# EAGLE design display (EAGLE 7.7.0)
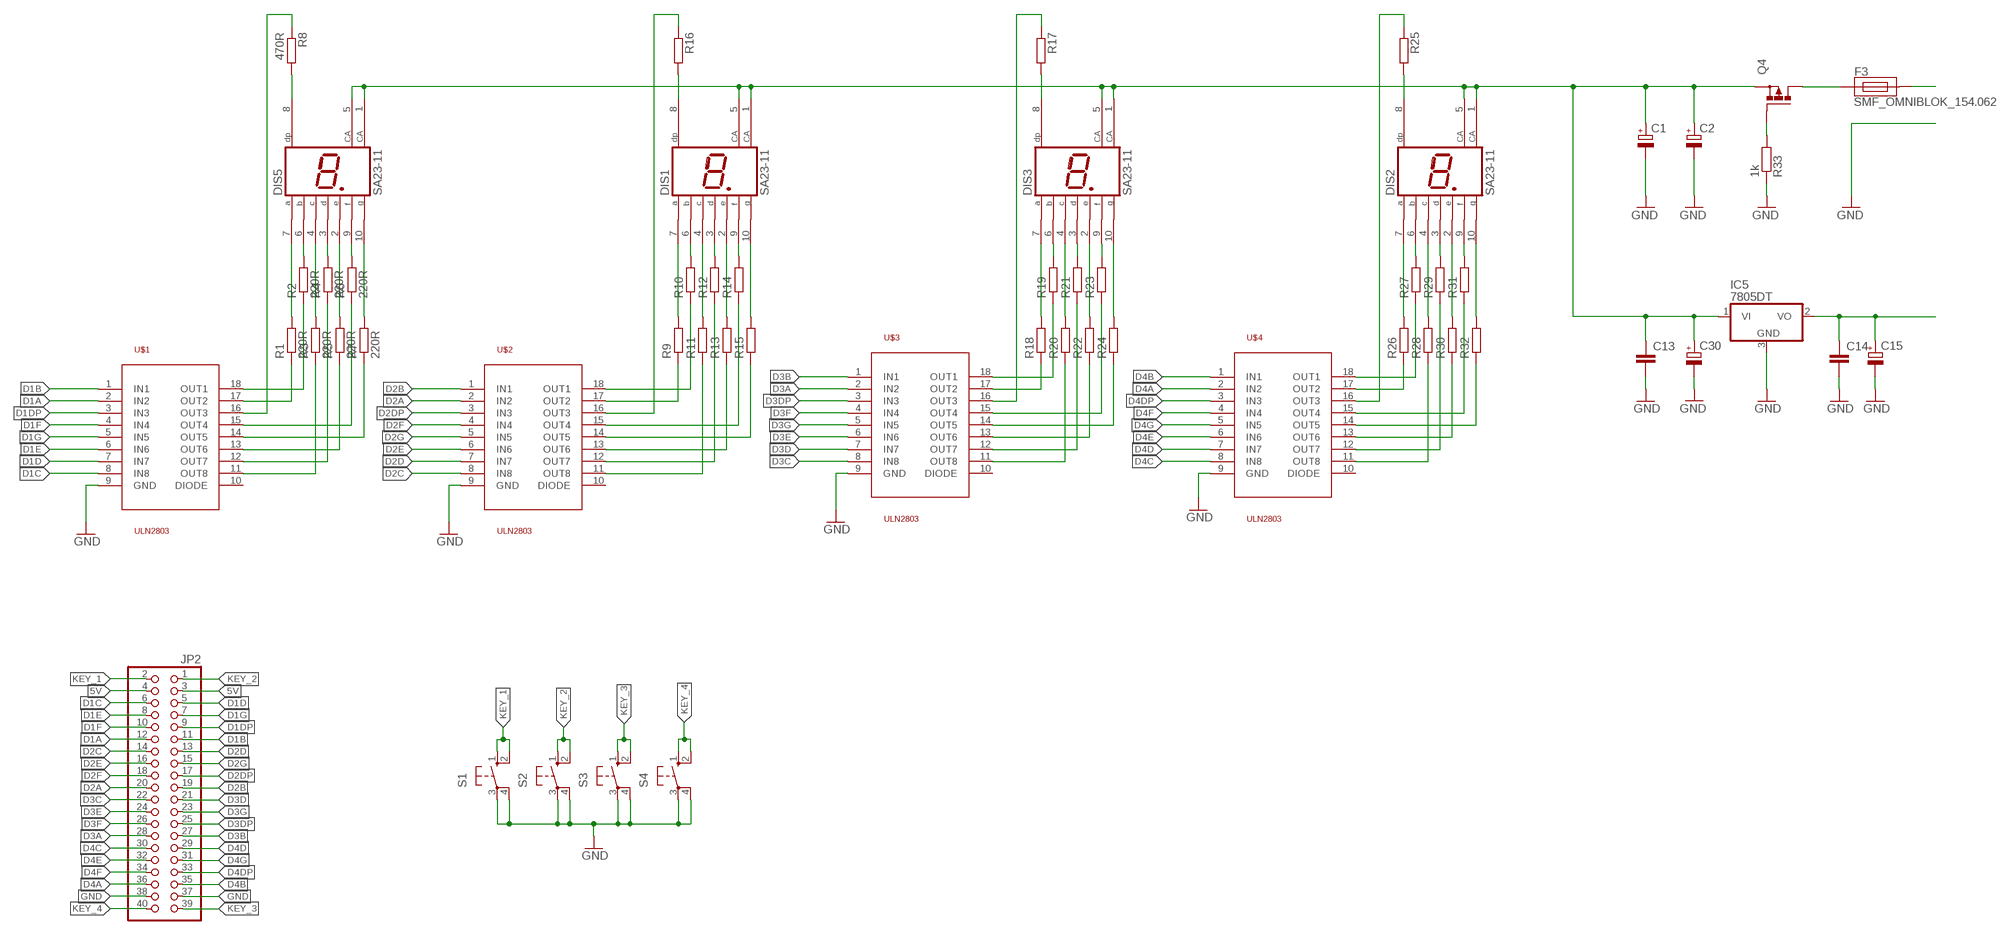
[diagram p0: schematic, sheet 1]

## Parts
C1  CPOL-EUSMCD  [SMC_D]
C2  CPOL-EUSMCD  [SMC_D]
C13  C-EUC0603  [C0603]
C14  C-EUC0603  [C0603]
C15  CPOL-EUSMCB  [SMC_B]
C30  CPOL-EUSMCC  [SMC_C]
DIS1  SA23-11  [SX23-XX]
DIS2  SA23-11  [SX23-XX]
DIS3  SA23-11  [SX23-XX]
DIS5  SA23-11  [SX23-XX]
F3  SMF_OMNIBLOK_154.062  [NANO2_SMF_FUSEBLOCK]
IC5  7805DT  [TO252]
JP2  PINHD-2X20_2.54-SMD  [2X20SMD]
Q4  P-MOSFET-SO8  [SO-08]
R1  220R  R-EU_R0603  [R0603]
R2  220R  R-EU_R0603  [R0603]
R3  220R  R-EU_R0603  [R0603]
R4  220R  R-EU_R0603  [R0603]
R5  220R  R-EU_R0603  [R0603]
R6  220R  R-EU_R0603  [R0603]
R7  220R  R-EU_R0603  [R0603]
R8  470R  R-EU_R0603  [R0603]
R9  R-EU_R0603  [R0603]
R10  R-EU_R0603  [R0603]
R11  R-EU_R0603  [R0603]
R12  R-EU_R0603  [R0603]
R13  R-EU_R0603  [R0603]
R14  R-EU_R0603  [R0603]
R15  R-EU_R0603  [R0603]
R16  R-EU_R0603  [R0603]
R17  R-EU_R0603  [R0603]
R18  R-EU_R0603  [R0603]
R19  R-EU_R0603  [R0603]
R20  R-EU_R0603  [R0603]
R21  R-EU_R0603  [R0603]
R22  R-EU_R0603  [R0603]
R23  R-EU_R0603  [R0603]
R24  R-EU_R0603  [R0603]
R25  R-EU_R0603  [R0603]
R26  R-EU_R0603  [R0603]
R27  R-EU_R0603  [R0603]
R28  R-EU_R0603  [R0603]
R29  R-EU_R0603  [R0603]
R30  R-EU_R0603  [R0603]
R31  R-EU_R0603  [R0603]
R32  R-EU_R0603  [R0603]
R33  1k  R-EU_R0603  [R0603]
S1  40-XX  [B3F-40XX]
S2  40-XX  [B3F-40XX]
S3  40-XX  [B3F-40XX]
S4  40-XX  [B3F-40XX]
U$1  ULN2803  [SO18L]
U$2  ULN2803  [SO18L]
U$3  ULN2803  [SO18L]
U$4  ULN2803  [SO18L]

## Nets
5V: C14.1 C15.+ IC5.2(VO) JP2.3 JP2.4
9V: C1.+ C2.+ C13.1 C30.+ DIS1.1(CA) DIS1.5(CA) DIS2.1(CA) DIS2.5(CA) DIS3.1(CA) DIS3.5(CA) DIS5.1(CA) DIS5.5(CA) IC5.1(VI) Q4.1(S) Q4.2(S) Q4.3(S)
D1A: JP2.12 U$1.2(IN2)
D1B: JP2.11 U$1.1(IN1)
D1C: JP2.6 U$1.8(IN8)
D1D: JP2.5 U$1.7(IN7)
D1DP: JP2.9 U$1.3(IN3)
D1E: JP2.8 U$1.6(IN6)
D1F: JP2.10 U$1.4(IN4)
D1G: JP2.7 U$1.5(IN5)
D2A: JP2.20 U$2.2(IN2)
D2B: JP2.19 U$2.1(IN1)
D2C: JP2.14 U$2.8(IN8)
D2D: JP2.13 U$2.7(IN7)
D2DP: JP2.17 U$2.3(IN3)
D2E: JP2.16 U$2.6(IN6)
D2F: JP2.18 U$2.4(IN4)
D2G: JP2.15 U$2.5(IN5)
D3A: JP2.28 U$3.2(IN2)
D3B: JP2.27 U$3.1(IN1)
D3C: JP2.22 U$3.8(IN8)
D3D: JP2.21 U$3.7(IN7)
D3DP: JP2.25 U$3.3(IN3)
D3E: JP2.24 U$3.6(IN6)
D3F: JP2.26 U$3.4(IN4)
D3G: JP2.23 U$3.5(IN5)
D4A: JP2.36 U$4.2(IN2)
D4B: JP2.35 U$4.1(IN1)
D4C: JP2.30 U$4.8(IN8)
D4D: JP2.29 U$4.7(IN7)
D4DP: JP2.33 U$4.3(IN3)
D4E: JP2.32 U$4.6(IN6)
D4F: JP2.34 U$4.4(IN4)
D4G: JP2.31 U$4.5(IN5)
GND: C1.- C2.- C13.2 C14.2 C15.- C30.- IC5.3(GND) JP2.37 JP2.38 R33.1 S1.3(P) S1.4(P1) S2.3(P) S2.4(P1) S3.3(P) S3.4(P1) S4.3(P) S4.4(P1) U$1.9(GND) U$2.9(GND) U$3.9(GND) U$4.9(GND)
KEY_1: JP2.2 S1.1(S) S1.2(S1)
KEY_2: JP2.1 S2.1(S) S2.2(S1)
KEY_3: JP2.39 S3.1(S) S3.2(S1)
KEY_4: JP2.40 S4.1(S) S4.2(S1)
N$1: DIS5.7(A) R1.2
N$2: DIS5.6(B) R2.2
N$3: F3.2
N$4: Q4.4(G) R33.2
N$11: DIS5.4(C) R3.2
N$12: DIS5.3(D) R4.2
N$13: DIS5.2(E) R5.2
N$14: DIS5.9(F) R6.2
N$15: DIS5.10(G) R7.2
N$16: DIS5.8(DP) R8.2
N$17: DIS1.7(A) R9.2
N$18: DIS1.4(C) R11.2
N$19: DIS1.2(E) R13.2
N$20: DIS1.10(G) R15.2
N$21: DIS1.6(B) R10.2
N$22: DIS1.3(D) R12.2
N$23: DIS1.9(F) R14.2
N$24: DIS1.8(DP) R16.2
N$25: DIS3.8(DP) R17.2
N$26: DIS3.7(A) R18.2
N$27: DIS3.4(C) R20.2
N$37: DIS3.2(E) R22.2
N$40: DIS3.10(G) R24.2
N$41: DIS3.6(B) R19.2
N$42: DIS3.3(D) R21.2
N$43: DIS3.9(F) R23.2
N$44: DIS2.8(DP) R25.2
N$45: DIS2.7(A) R26.2
N$46: DIS2.4(C) R28.2
N$47: DIS2.2(E) R30.2
N$52: F3.1 Q4.5(D) Q4.6(D) Q4.7(D) Q4.8(D)
N$53: DIS2.10(G) R32.2
N$54: DIS2.6(B) R27.2
N$55: DIS2.3(D) R29.2
N$56: DIS2.9(F) R31.2
N$57: R5.1 U$1.13(OUT6)
N$58: R4.1 U$1.12(OUT7)
N$59: R3.1 U$1.11(OUT8)
N$60: R7.1 U$1.14(OUT5)
N$69: R6.1 U$1.15(OUT4)
N$70: R8.1 U$1.16(OUT3)
N$71: R1.1 U$1.17(OUT2)
N$72: R2.1 U$1.18(OUT1)
N$73: R15.1 U$2.14(OUT5)
N$74: R14.1 U$2.15(OUT4)
N$75: R16.1 U$2.16(OUT3)
N$76: R9.1 U$2.17(OUT2)
N$77: R10.1 U$2.18(OUT1)
N$78: R11.1 U$2.11(OUT8)
N$79: R12.1 U$2.12(OUT7)
N$80: R13.1 U$2.13(OUT6)
N$81: R24.1 U$3.14(OUT5)
N$82: R23.1 U$3.15(OUT4)
N$83: R17.1 U$3.16(OUT3)
N$84: R18.1 U$3.17(OUT2)
N$85: R19.1 U$3.18(OUT1)
N$86: R20.1 U$3.11(OUT8)
N$87: R21.1 U$3.12(OUT7)
N$88: R22.1 U$3.13(OUT6)
N$89: R32.1 U$4.14(OUT5)
N$90: R31.1 U$4.15(OUT4)
N$91: R25.1 U$4.16(OUT3)
N$92: R26.1 U$4.17(OUT2)
N$93: R27.1 U$4.18(OUT1)
N$94: R28.1 U$4.11(OUT8)
N$95: R29.1 U$4.12(OUT7)
N$96: R30.1 U$4.13(OUT6)
Unconnected: U$1.10(DIODE) U$2.10(DIODE) U$3.10(DIODE) U$4.10(DIODE)

## Library data of the parts
C1 C2 C15 C30 = rcl:CPOL-EU: POLARIZED CAPACITOR, European symbol
C13 C14 = rcl:C-EU: CAPACITOR, European symbol
DIS1-DIS3 DIS5 = display-kingbright:SA23-11: LED DISPLAY 1-character 7 segment, decimal point right
F3 = _hhn_littlefuse_Nano2SMF_2:SMF_OMNIBLOK_154: Littlefuse SMF OMNI-BLOK (R) Fuse Holder with Installed Fuse (NANO2 SMF): Series 154 Source: http://www.littlefuse.com Technologies (ROHS-compliant): Very Fast-Acting Fuse Installed: 154.x = rating x mA 154 0[..]y = rating y A Slow-Acting Fuse Installed (Slo-Blo (R)) 154.xT = rating x mA 154 0[..]yT = rating y A Author: Dipl.-Ing. FH Rainer Bayer HHN Hochschule Heilbronn, rainer.bayer@hs-heilbronn.de Ingenieurbüro ing-rb, mail@ing-rb.de
IC5 = linear:78*: Positive VOLTAGE REGULATOR Source: http://cache.national.com/ds/LM/LM78L05.pdf http://www.fairchildsemi.com/ds/LM/LM7805.pdf
JP2 = pinhead-2:PINHD-2X20: PIN HEADER
Q4 = transistor-power:P-MOSFET-SO8: P-Channel MOSFET Example: FDS4435A; P-Channel Logic Level PowerTrench® MOSFET FDS4465; P-Channel 1.8V Specified PowerTrench® MOSFET Source: www.fairchildsemi.com
R1-R33 = rcl:R-EU_: RESISTOR, European symbol
S1-S4 = switch-omron:40-XX: OMRON SWITCH; MF: OMRON COMPONENTS USA; MPN: B3F-4000; OC_FARNELL: 176434; OC_NEWARK: 36K3105
U$1-U$4 = uln2803:ULN2803

## Board
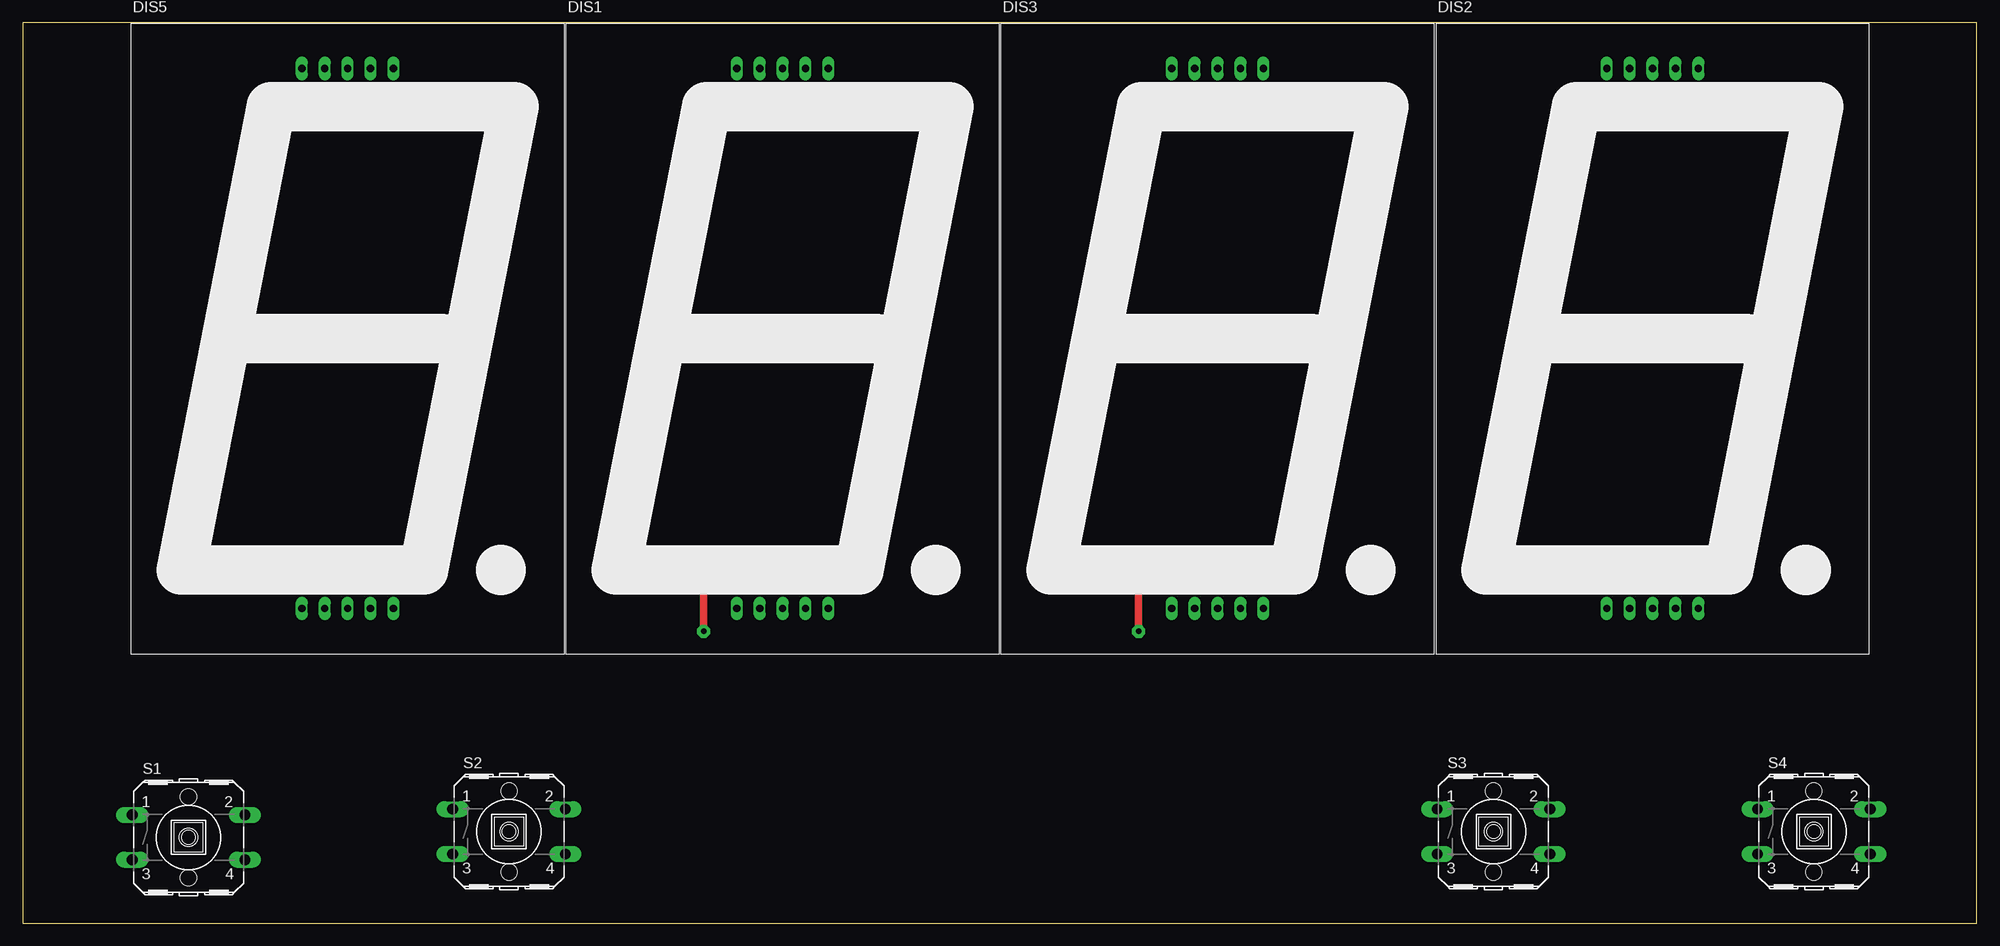
[diagram p1: board, top side]
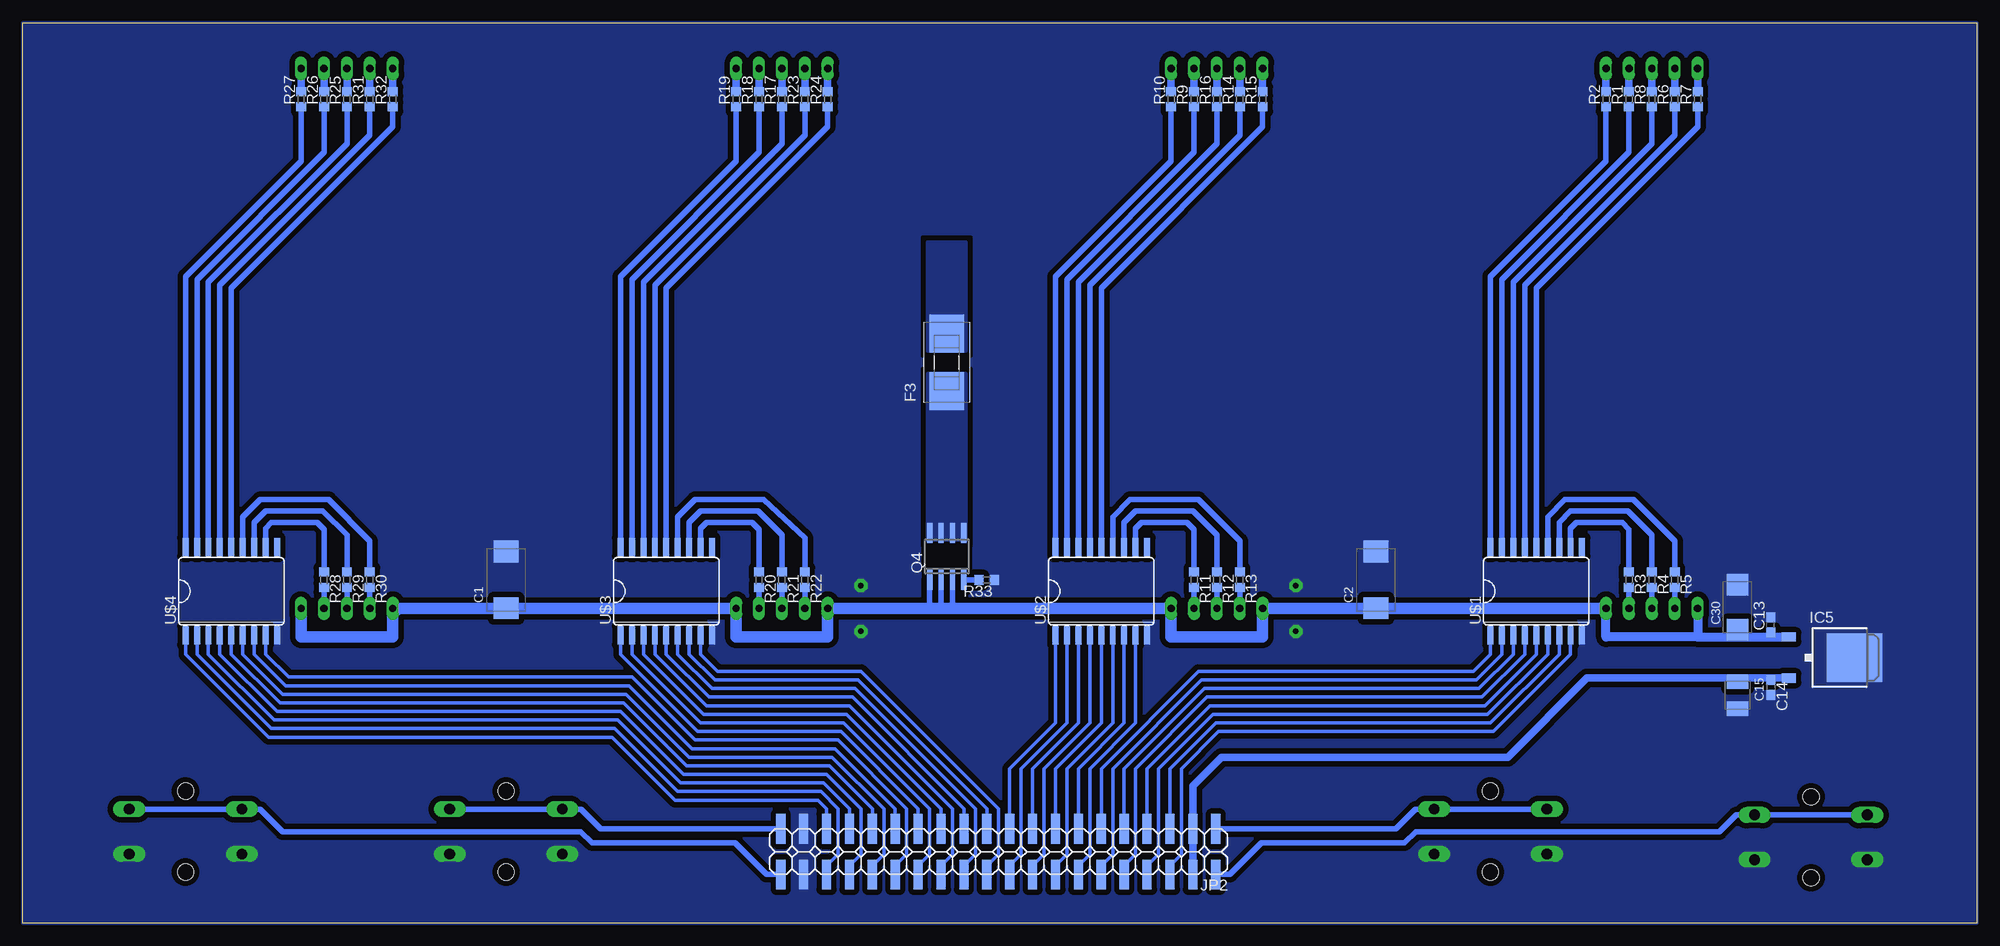
[diagram p2: board, bottom side, seen from below]

Size 216.84 x 99.95 mm. Coordinates in mm from the lower left corner, seen from the top.
Outline: 0,0 216.84,0 216.84,99.95 0,99.95 0,0
Copper layers (1*16): Top 0.035mm / dielectric 1.5mm / Bottom 0.035mm
Design rules "default *": minimum track width 10mil, minimum drill 24mil, track to track 8mil, track to pad 8mil, pad to pad 8mil, via to via 8mil, smd to smd 8mil, copper to edge 0mil, drill to drill 8mil, minimum pad ring 10mil, minimum via ring 8mil, stop-mask expansion 4mil, vias tented up to drill 0mil, thermal gap 10mil
bRestrict: area 112.4,61.6 to 116.2,62.9; area 112.1,39.4 to 116.5,41.9

### Footprints (pad centres in the part's own frame; a part is rotated, then mirrored left to right if it is on the bottom)
SMC_D = smd 2.4 x 2.8: + -3.15,0; - 3.15,0
C0603 = smd 1.1 x 1: 1 -0.85,0; 2 0.85,0
SMC_B = smd 1.6 x 2.4: + -1.5,0; - 1.5,0
SMC_C = smd 2.4 x 2.4: + -2.5,0; - 2.5,0
SX23-XX = drill 0.813 long: 1 18.923,5.08; 2 21.463,5.08; 3 24.003,5.08; 4 26.543,5.08; 5 29.083,5.08; 6 29.083,65.024; 7 26.543,65.024; 8 24.003,65.024; 9 21.463,65.024; 10 18.923,65.024
NANO2_SMF_FUSEBLOCK = smd 4.24 x 3.81: 1 -3.19,0; 2 3.19,0
TO252 = smd 1 x 1.6: 1 -2.28,-4.8; 2 2.28,-4.8 | smd 5.4 x 6.2: 3 0,2.5
2X20SMD = smd 1.016 x 3.302: 1 -1.27,-3.81; 2 -1.27,1.27; 3 1.27,-3.81; 4 1.27,1.27; 5 3.81,-3.81; 6 3.81,1.27; 7 6.35,-3.81; 8 6.35,1.27; 9 8.89,-3.81; 10 8.89,1.27; 11 11.43,-3.81; 12 11.43,1.27; 13 13.97,-3.81; 14 13.97,1.27; 15 16.51,-3.81; 16 16.51,1.27; 17 19.05,-3.81; 18 19.05,1.27; 19 21.59,-3.81; 20 21.59,1.27; 21 24.13,-3.81; 22 24.13,1.27; 23 26.67,-3.81; 24 26.67,1.27; 25 29.21,-3.81; 26 29.21,1.27; 27 31.75,-3.81; 28 31.75,1.27; 29 34.29,-3.81; 30 34.29,1.27; 31 36.83,-3.81; 32 36.83,1.27; 33 39.37,-3.81; 34 39.37,1.27; 35 41.91,-3.81; 36 41.91,1.27; 37 44.45,-3.81; 38 44.45,1.27; 39 46.99,-3.81; 40 46.99,1.27
SO-08 = smd 0.6 x 2.2: 1 -1.905,-2.6; 2 -0.635,-2.6; 3 0.635,-2.6; 4 1.905,-2.6; 5 1.905,2.6; 6 0.635,2.6; 7 -0.635,2.6; 8 -1.905,2.6
R0603 = smd 1 x 1.1: 1 -0.85,0; 2 0.85,0
B3F-40XX = drill 1.194 long: 1 -6.248,2.489; 2 6.248,2.489; 3 -6.248,-2.489; 4 6.248,-2.489 | hole 1.803: 0,-4.496; 0,4.496
SO18L = smd 0.66 x 2.032: 1 -5.08,-4.902; 2 -3.81,-4.902; 3 -2.54,-4.902; 4 -1.27,-4.902; 5 0,-4.902; 6 1.27,-4.902; 7 2.54,-4.902; 8 3.81,-4.902; 9 5.08,-4.902; 10 5.08,4.902; 11 3.81,4.902; 12 2.54,4.902; 13 1.27,4.902; 14 0,4.902; 15 -1.27,4.902; 16 -2.54,4.902; 17 -3.81,4.902; 18 -5.08,4.902

### Placement (x,y rotation side)
C1  163.19,38.1 90 bottom
C2  66.67,38.1 90 bottom
C13  22.89,33.1 90 bottom
C14  22.89,26.16 270 bottom
C15  26.57,25.3 270 bottom
C30  26.57,35.05 90 bottom
DIS1  60.33,29.84 0 top
DIS2  156.84,29.84 0 top
DIS3  108.58,29.84 0 top
DIS5  12.06,29.84 0 top
F3  114.3,62.23 90 bottom
IC5  16.08,29.47 270 bottom
JP2  85.72,6.67 180 bottom
Q4  114.3,40.69 0 bottom
R1  38.61,91.44 90 bottom
R2  41.15,91.44 90 bottom
R3  38.61,38.1 270 bottom
R4  36.07,38.1 270 bottom
R5  33.53,38.1 270 bottom
R6  33.53,91.44 90 bottom
R7  30.99,91.44 90 bottom
R8  36.07,91.44 90 bottom
R9  86.87,91.44 90 bottom
R10  89.41,91.44 90 bottom
R11  86.87,38.1 270 bottom
R12  84.33,38.1 270 bottom
R13  81.79,38.1 270 bottom
R14  81.79,91.44 90 bottom
R15  79.25,91.44 90 bottom
R16  84.33,91.44 90 bottom
R17  132.59,91.44 90 bottom
R18  135.13,91.44 90 bottom
R19  137.67,91.44 90 bottom
R20  135.13,38.1 270 bottom
R21  132.59,38.1 270 bottom
R22  130.05,38.1 270 bottom
R23  130.05,91.44 90 bottom
R24  127.51,91.44 90 bottom
R25  180.85,91.44 90 bottom
R26  183.39,91.44 90 bottom
R27  185.93,91.44 90 bottom
R28  183.39,38.1 270 bottom
R29  180.85,38.1 270 bottom
R30  178.31,38.1 270 bottom
R31  178.31,91.44 90 bottom
R32  175.77,91.44 90 bottom
R33  109.86,38.09 180 bottom
S1  18.41,9.53 0 top
S2  53.98,10.16 0 top
S3  163.19,10.16 0 top
S4  198.75,10.16 0 top
U$1  48.9,36.83 0 bottom
U$2  97.16,36.83 0 bottom
U$3  145.41,36.83 0 bottom
U$4  193.68,36.83 0 bottom

### Tracks (layer width: path | path; a pad name or v marks a point on that pad's centre or on a via)
5V
  Bottom 0.406: C14.1 22.86,27.01 22.86,27.19 | C15.+ 26.67,26.8 26.67,27.19
  Bottom 0.813: JP2.4 JP2.3 87,15.24 83.82,18.41 52.07,18.41 43.3,27.19 26.67,27.19 22.86,27.19 IC5.2
9V
  Bottom 0.406: C13.1 22.86,32.25 22.86,31.75 | C30.+ 26.67,32.55 26.67,31.75 | C2.+ 66.67,34.92 | C1.+ 163.19,34.92
  Bottom 0.61: Q4.3 113.67,34.92 | Q4.2 114.94,34.92 | Q4.1 116.2,34.92
  Bottom 1.016: DIS5.1 30.99,31.75 | 30.99,31.75 41.15,31.75 DIS5.5 | 30.99,31.75 26.67,31.75 22.86,31.75 IC5.1
  Bottom 1.27: DIS2.1 175.77,34.29 | 175.77,34.29 175.77,31.75 185.93,31.75 DIS2.5 | 175.77,34.29 175.13,34.92 163.19,34.92 DIS3.5 137.67,31.75 127.51,31.75 DIS3.1 116.2,34.92 114.94,34.92 113.67,34.92 DIS1.5 89.41,31.75 79.25,31.75 DIS1.1 66.67,34.92 DIS5.5
D1A
  Bottom 0.406: U$1.2 52.7,29.84 55.56,26.99 86.04,26.99 95.89,17.14 95.89,7.62 97.16,6.35 JP2.12
D1B
  Bottom 0.406: U$1.1 53.98,29.84 55.88,27.94 86.36,27.94 97.16,17.14 JP2.11
D1C
  Bottom 0.406: U$1.8 45.09,29.84 53.66,21.27 84.14,21.27 88.27,17.14 88.27,7.62 89.53,6.35 JP2.6
D1D
  Bottom 0.406: U$1.7 46.35,29.84 53.98,22.23 84.45,22.23 89.53,17.14 JP2.5
D1DP
  Bottom 0.406: U$1.3 51.44,29.84 55.24,26.04 85.72,26.04 94.61,17.14 JP2.9
D1E
  Bottom 0.406: U$1.6 47.62,29.84 54.29,23.18 84.77,23.18 90.81,17.14 90.81,7.62 92.08,6.35 JP2.8
D1F
  Bottom 0.406: U$1.4 50.16,29.84 54.93,25.08 85.41,25.08 93.34,17.14 93.34,7.62 94.61,6.35 JP2.10
D1G
  Bottom 0.406: U$1.5 48.9,29.84 54.61,24.13 85.09,24.13 92.08,17.14 JP2.7
D2A
  Bottom 0.406: U$2.2 100.97,22.23 106.05,17.14 106.05,7.62 107.31,6.35 JP2.20
D2B
  Bottom 0.406: U$2.1 102.23,22.23 107.31,17.14 JP2.19
D2C
  Bottom 0.406: U$2.8 93.34,22.23 98.42,17.14 98.42,7.62 99.69,6.35 JP2.14
D2D
  Bottom 0.406: U$2.7 94.61,22.23 99.69,17.14 JP2.13
D2DP
  Bottom 0.406: U$2.3 99.69,22.23 104.78,17.14 JP2.17
D2E
  Bottom 0.406: U$2.6 95.89,22.23 100.97,17.14 100.97,7.62 102.23,6.35 JP2.16
D2F
  Bottom 0.406: U$2.4 98.42,22.23 103.5,17.14 103.5,7.62 104.78,6.35 JP2.18
D2G
  Bottom 0.406: U$2.5 97.16,22.23 102.23,17.14 JP2.15
D3A
  Bottom 0.406: U$3.2 149.22,29.84 141.6,22.23 125.73,22.23 116.2,12.7 116.2,7.62 117.47,6.35 JP2.28
D3B
  Bottom 0.406: U$3.1 150.5,29.84 141.92,21.27 126.05,21.27 117.47,12.7 JP2.27
D3C
  Bottom 0.406: U$3.8 141.6,29.84 139.7,27.94 123.83,27.94 108.58,12.7 108.58,7.62 109.86,6.35 JP2.22
D3D
  Bottom 0.406: U$3.7 142.88,29.84 140.02,26.99 124.14,26.99 109.86,12.7 JP2.21
D3DP
  Bottom 0.406: U$3.3 147.96,29.84 141.29,23.18 125.41,23.18 114.94,12.7 JP2.25
D3E
  Bottom 0.406: U$3.6 144.15,29.84 140.34,26.04 124.46,26.04 111.12,12.7 111.12,7.62 112.39,6.35 JP2.24
D3F
  Bottom 0.406: U$3.4 146.69,29.84 140.97,24.13 125.09,24.13 113.67,12.7 113.67,7.62 114.94,6.35 JP2.26
D3G
  Bottom 0.406: U$3.5 145.41,29.84 140.65,25.08 124.78,25.08 112.39,12.7 JP2.23
D4A
  Bottom 0.406: U$4.2 197.49,29.84 189.23,21.59 151.13,21.59 144.15,14.61 128.27,14.61 126.36,12.7 126.36,7.62 127.64,6.35 JP2.36
D4B
  Bottom 0.406: U$4.1 198.75,29.84 189.55,20.64 151.45,20.64 144.46,13.65 128.59,13.65 127.64,12.7 JP2.35
D4C
  Bottom 0.406: U$4.8 189.87,29.84 187.32,27.3 149.22,27.3 142.24,20.32 126.36,20.32 118.75,12.7 118.75,7.62 120.02,6.35 JP2.30
D4D
  Bottom 0.406: U$4.7 191.13,29.84 187.64,26.35 149.54,26.35 142.56,19.37 126.68,19.37 120.02,12.7 JP2.29
D4DP
  Bottom 0.406: U$4.3 196.22,29.84 188.91,22.54 150.81,22.54 143.83,15.56 127.95,15.56 125.09,12.7 JP2.33
D4E
  Bottom 0.406: U$4.6 192.41,29.84 187.96,25.4 149.86,25.4 142.88,18.41 127,18.41 121.28,12.7 121.28,7.62 122.56,6.35 JP2.32
D4F
  Bottom 0.406: U$4.4 194.94,29.84 188.59,23.5 150.5,23.5 143.51,16.51 127.64,16.51 123.83,12.7 123.83,7.62 125.09,6.35 JP2.34
D4G
  Bottom 0.406: U$4.5 193.68,29.84 188.28,24.45 150.18,24.45 143.19,17.46 127.32,17.46 122.56,12.7 JP2.31
GND  (via drill 0.6 pad 1.42)
  Top 0.813: v75.56,37.47 v75.56,32.38 | v123.83,37.47 v123.83,32.38
  pour Bottom (isolate 0.61, rank 2, no thermals): 0,99.95 0,0 216.84,0 216.84,99.95
KEY_1
  Bottom 0.61: JP2.2 82.87,5.4 79.38,8.89 63.5,8.89 62.23,10.16 28.57,10.16 26.72,12.01 25.4,12.01 S1.2 S1.1
KEY_2
  Bottom 0.61: JP2.1 64.45,10.48 62.28,12.65 S2.2 S2.1
KEY_3
  Bottom 0.61: JP2.39 152.72,10.48 154.89,12.65 S3.1 S3.2
KEY_4
  Bottom 0.61: JP2.40 134.3,5.4 137.79,8.89 153.67,8.89 154.94,10.16 187.96,10.16 190.45,12.65 S4.1 S4.2
N$1
  Bottom 0.813: R1.2 DIS5.7
N$2
  Bottom 0.813: R2.2 DIS5.6
N$3
  pour Bottom (isolate 0.406, no thermals): 112.17,75.56 112.17,63.47 116.43,63.47 116.43,75.56
N$4
  Bottom 0.61: R33.2 Q4.4
N$11
  Bottom 0.61: DIS5.4 R3.2
N$12
  Bottom 0.61: DIS5.3 R4.2
N$13
  Bottom 0.61: DIS5.2 R5.2
N$14
  Bottom 0.813: R6.2 DIS5.9
N$15
  Bottom 0.813: R7.2 DIS5.10
N$16
  Bottom 0.813: R8.2 DIS5.8
N$17
  Bottom 0.813: R9.2 DIS1.7
N$18
  Bottom 0.61: DIS1.4 R11.2
N$19
  Bottom 0.61: DIS1.2 R13.2
N$20
  Bottom 0.813: R15.2 DIS1.10
N$21
  Bottom 0.813: R10.2 DIS1.6
N$22
  Bottom 0.61: DIS1.3 R12.2
N$23
  Bottom 0.813: R14.2 DIS1.9
N$24
  Bottom 0.813: R16.2 DIS1.8
N$25
  Bottom 0.813: R17.2 DIS3.8
N$26
  Bottom 0.813: R18.2 DIS3.7
N$27
  Bottom 0.61: DIS3.4 R20.2
N$37
  Bottom 0.61: DIS3.2 R22.2
N$40
  Bottom 0.813: R24.2 DIS3.10
N$41
  Bottom 0.813: R19.2 DIS3.6
N$42
  Bottom 0.61: DIS3.3 R21.2
N$43
  Bottom 0.813: R23.2 DIS3.9
N$44
  Bottom 0.813: R25.2 DIS2.8
N$45
  Bottom 0.813: R26.2 DIS2.7
N$46
  Bottom 0.61: DIS2.4 R28.2
N$47
  Bottom 0.61: DIS2.2 R30.2
N$52
  pour Bottom (isolate 0.406, no thermals): 112.17,60.99 112.17,42.37 116.43,42.37 116.43,60.99
N$53
  Bottom 0.813: R32.2 DIS2.10
N$54
  Bottom 0.813: R27.2 DIS2.6
N$55
  Bottom 0.61: DIS2.3 R29.2
N$56
  Bottom 0.813: R31.2 DIS2.9
N$57
  Bottom 0.61: U$1.13 47.62,45.09 45.72,46.99 38.1,46.99 33.53,42.42 R5.1
N$58
  Bottom 0.61: U$1.12 46.35,44.45 45.09,45.72 38.73,45.72 36.07,43.05 R4.1
N$59
  Bottom 0.61: U$1.11 45.09,43.81 44.45,44.45 39.37,44.45 38.61,43.69 R3.1
N$60
  Bottom 0.61: R7.1 30.99,88.39 48.9,70.48 U$1.14
N$69
  Bottom 0.61: R6.1 33.53,87.44 50.16,70.8 U$1.15
N$70
  Bottom 0.61: R8.1 36.07,86.49 51.44,71.12 U$1.16
N$71
  Bottom 0.61: R1.1 38.61,85.53 52.7,71.44 U$1.17
N$72
  Bottom 0.61: R2.1 41.15,84.58 53.98,71.75 U$1.18
N$73
  Bottom 0.61: R15.1 79.25,88.39 97.16,70.48 U$2.14
N$74
  Bottom 0.61: U$2.15 98.42,70.8 81.79,87.44 R14.1
N$75
  Bottom 0.61: R16.1 84.33,86.49 99.69,71.12 U$2.16
N$76
  Bottom 0.61: R9.1 86.87,85.53 100.97,71.44 U$2.17
N$77
  Bottom 0.61: R10.1 89.41,84.58 102.23,71.75 U$2.18
N$78
  Bottom 0.61: U$2.11 93.34,43.81 92.71,44.45 87.63,44.45 86.87,43.69 R11.1
N$79
  Bottom 0.61: U$2.12 94.61,44.45 93.34,45.72 87,45.72 84.33,43.05 R12.1
N$80
  Bottom 0.61: U$2.13 95.89,45.09 93.98,46.99 86.36,46.99 81.79,42.42 R13.1
N$81
  Bottom 0.61: R24.1 127.51,88.39 145.41,70.48 U$3.14
N$82
  Bottom 0.61: R23.1 130.05,87.44 146.69,70.8 U$3.15
N$83
  Bottom 0.61: R17.1 132.59,86.49 147.96,71.12 U$3.16
N$84
  Bottom 0.61: R18.1 135.13,85.53 149.22,71.44 U$3.17
N$85
  Bottom 0.61: R19.1 137.67,84.58 150.5,71.75 U$3.18
N$86
  Bottom 0.61: U$3.11 141.6,43.81 140.97,44.45 135.89,44.45 135.13,43.69 R20.1
N$87
  Bottom 0.61: U$3.12 142.88,44.45 141.6,45.72 135.25,45.72 132.59,43.05 R21.1
N$88
  Bottom 0.61: U$3.13 144.15,45.09 142.24,46.99 134.62,46.99 130.05,42.74 R22.1
N$89
  Bottom 0.61: R32.1 175.77,88.39 193.68,70.48 U$4.14
N$90
  Bottom 0.61: R31.1 178.31,87.44 194.94,70.8 U$4.15
N$91
  Bottom 0.61: R25.1 180.85,86.49 196.22,71.12 U$4.16
N$92
  Bottom 0.61: R26.1 183.39,85.53 197.49,71.44 U$4.17
N$93
  Bottom 0.61: R27.1 185.93,84.58 198.75,71.75 U$4.18
N$94
  Bottom 0.61: U$4.11 189.87,43.81 189.23,44.45 184.15,44.45 183.39,43.69 R28.1
N$95
  Bottom 0.61: U$4.12 191.13,44.45 189.87,45.72 183.51,45.72 180.85,43.05 R29.1
N$96
  Bottom 0.61: U$4.13 192.41,45.09 190.5,46.99 182.88,46.99 178.31,42.42 R30.1